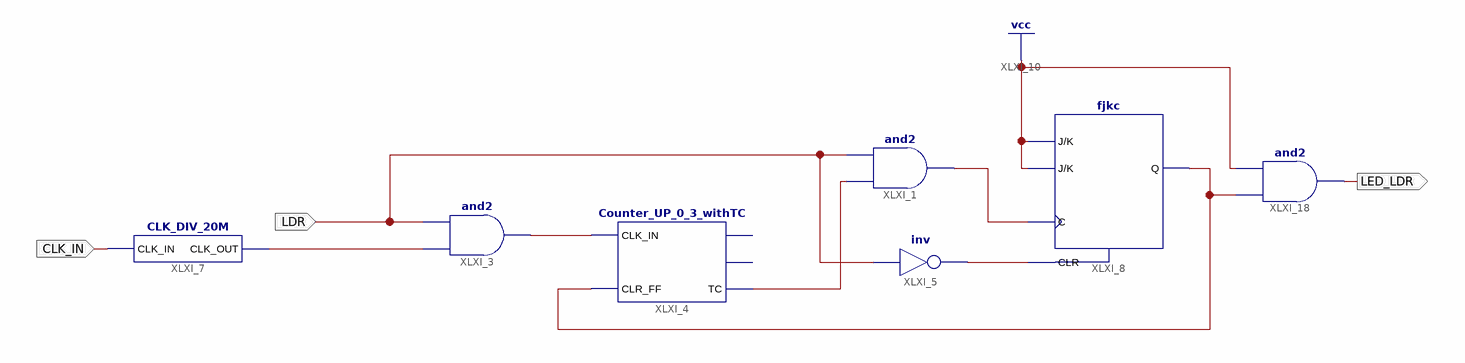
[diagram p0: schematic sheet 1]
// Xilinx ISE schematic LDR_LED_V3.sch (spartan6) as structural Verilog: 7 symbols, 3 ports
module LDR_LED_V3 (
  input  LDR,
  input  CLK_IN,
  output LED_LDR
);

  wire XLXN_2, XLXN_3, XLXN_17, XLXN_20, XLXN_21, XLXN_34;

  and XLXI_1 (XLXN_21, XLXN_2, LDR);
  and XLXI_3 (XLXN_3, XLXN_20, LDR);
  Counter_UP_0_3_withTC XLXI_4 (.CLK_IN(XLXN_3), .CLR_FF(XLXN_34), .TC(XLXN_2));  // open: D0, D1
  not XLXI_5 (XLXN_17, LDR);
  CLK_DIV_20M XLXI_7 (.CLK_IN(CLK_IN), .CLK_OUT(XLXN_20));
  fjkc XLXI_8 (.C(XLXN_21), .CLR(XLXN_17), .J(1'b1), .K(1'b1), .Q(XLXN_34));
  and XLXI_18 (LED_LDR, XLXN_34, 1'b1);
endmodule
